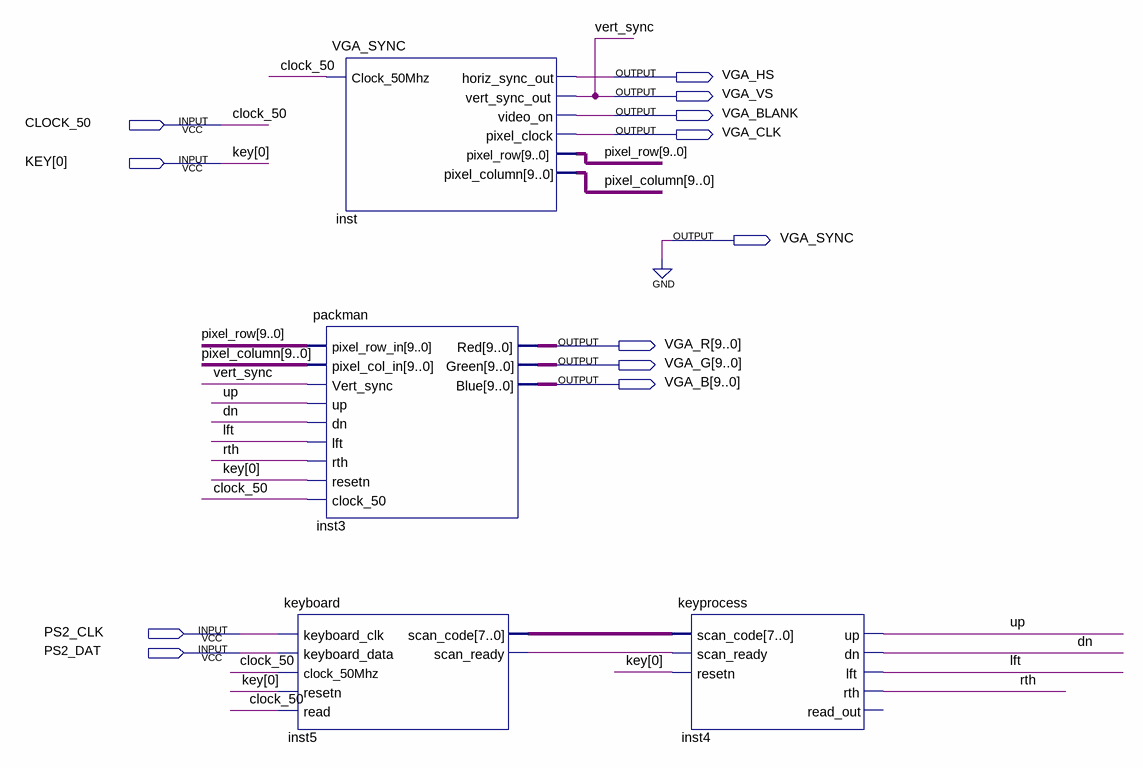
[diagram p0: schematic sheet]
// Quartus schematic packmantop.bdf as structural Verilog: 4 symbols, 12 pins
module packmantop (
  input  CLOCK_50,
  input  [0:0] KEY,
  input  PS2_CLK,
  input  PS2_DAT,
  output VGA_HS,
  output VGA_VS,
  output VGA_BLANK,
  output VGA_CLK,
  output VGA_SYNC,
  output [9:0] VGA_R,
  output [9:0] VGA_G,
  output [9:0] VGA_B
);

  wire dn, inst5_scan_ready, lft, rth, up;
  wire [7:0] inst5_scan_code;
  wire [9:0] pixel_column, pixel_row;

  packman inst3 (
    .pixel_row_in(pixel_row), .pixel_col_in(pixel_column), .Vert_sync(VGA_VS), .up(up), .dn(dn), .lft(lft),
    .rth(rth), .resetn(KEY[0]), .clock_50(CLOCK_50), .Red(VGA_R), .Green(VGA_G), .Blue(VGA_B));
  keyboard inst5 (
    .keyboard_clk(PS2_CLK), .keyboard_data(PS2_DAT), .clock_50Mhz(CLOCK_50), .resetn(KEY[0]),
    .read(CLOCK_50), .scan_code(inst5_scan_code), .scan_ready(inst5_scan_ready));
  VGA_SYNC inst (
    .Clock_50Mhz(CLOCK_50), .horiz_sync_out(VGA_HS), .vert_sync_out(VGA_VS), .video_on(VGA_BLANK),
    .pixel_clock(VGA_CLK), .pixel_row(pixel_row), .pixel_column(pixel_column));
  keyprocess inst4 (
    .scan_code(inst5_scan_code), .scan_ready(inst5_scan_ready), .resetn(KEY[0]), .up(up), .dn(dn), .lft(lft),
    .rth(rth));  // open: read_out

  assign VGA_SYNC = 1'b0;

  // Other names for the same wires on the sheet: vert_sync = VGA_VS
endmodule
